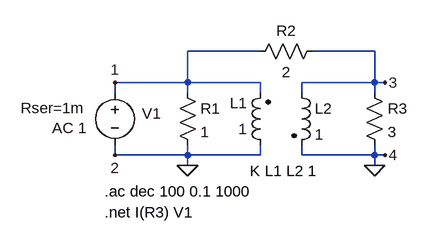
[diagram p0: schematic TS6_1.asc]
TS6_1.asc, the LTspice schematic file:
Version 4
SHEET 1 880 680
WIRE 32 48 -80 48
WIRE 208 48 112 48
WIRE -80 96 -80 48
WIRE -80 96 -192 96
WIRE 32 96 -80 96
WIRE 208 96 208 48
WIRE 208 96 96 96
WIRE 224 96 208 96
WIRE -192 112 -192 96
WIRE -80 112 -80 96
WIRE 32 112 32 96
WIRE 96 112 96 96
WIRE 208 112 208 96
WIRE -192 208 -192 192
WIRE -80 208 -80 192
WIRE -80 208 -192 208
WIRE 32 208 32 192
WIRE 32 208 -80 208
WIRE 96 208 96 192
WIRE 208 208 208 192
WIRE 208 208 96 208
WIRE 224 208 208 208
WIRE -80 224 -80 208
WIRE 208 224 208 208
FLAG -80 224 0
FLAG 208 224 0
FLAG -192 96 1
FLAG -192 208 2
FLAG 224 96 3
FLAG 224 208 4
SYMBOL ind2 48 208 R180
WINDOW 0 36 80 Left 2
WINDOW 3 36 40 Left 2
SYMATTR InstName L1
SYMATTR Value 1
SYMATTR Type ind
SYMBOL ind2 80 96 R0
SYMATTR InstName L2
SYMATTR Value 1
SYMATTR Type ind
SYMBOL res -96 96 R0
SYMATTR InstName R1
SYMATTR Value 1
SYMBOL res 192 96 R0
SYMATTR InstName R3
SYMATTR Value 3
SYMBOL res 128 32 R90
WINDOW 0 0 56 VBottom 2
WINDOW 3 32 56 VTop 2
SYMATTR InstName R2
SYMATTR Value 2
SYMBOL voltage -192 96 R0
WINDOW 0 42 48 Left 2
WINDOW 123 -97 70 Left 2
WINDOW 39 -145 39 Left 2
SYMATTR InstName V1
SYMATTR Value ""
SYMATTR Value2 AC 1
SYMATTR SpiceLine Rser=1m
TEXT 16 232 Left 2 !K L1 L2 1
TEXT -208 264 Left 2 !.ac dec 100 0.1 1000
TEXT -208 296 Left 2 !.net I(R3) V1

The netlist it stands for:
* TS6_1.asc
L1 0 1 1
L2 3 0 1
R1 1 0 1
R3 3 0 3
R2 3 1 2
V1 1 0 AC 1 Rser=1m
K L1 L2 1
.ac dec 100 0.1 1000
.net I(R3) V1
.backanno
.end